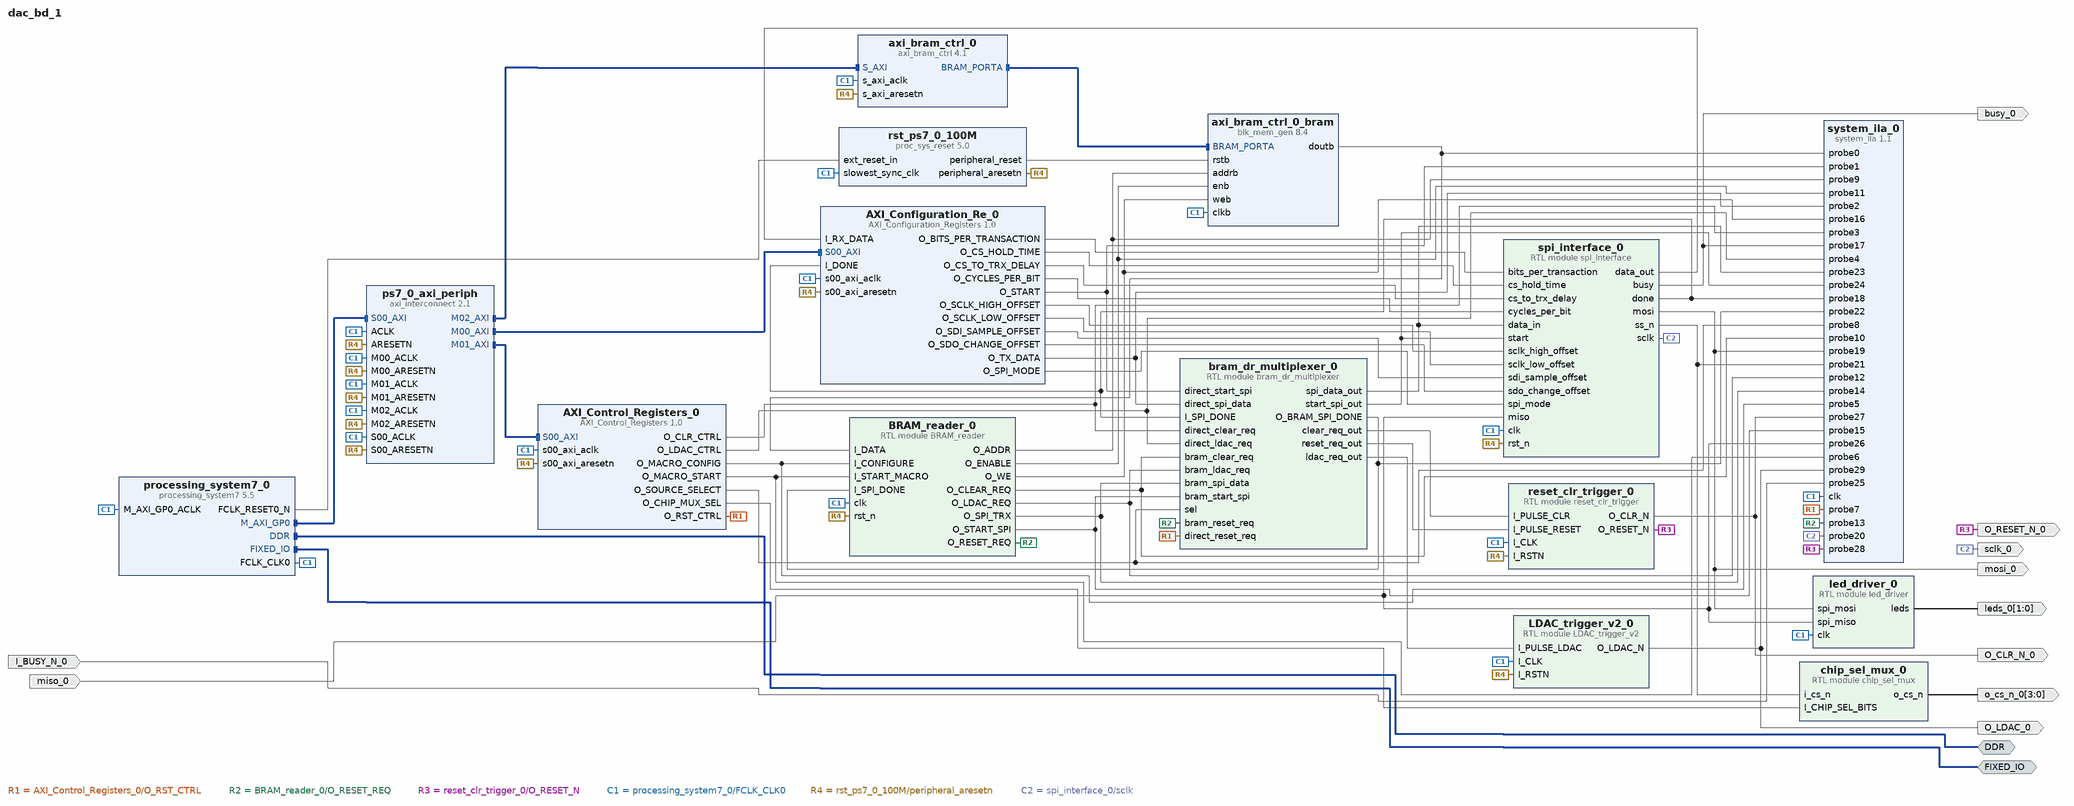
[diagram p0: block diagram of the top level]
# Vivado block design dac_bd_1, xc7z020clg400-1, Vivado 2023.1
create_bd_design dac_bd_1

create_bd_intf_port -mode Master -vlnv xilinx.com:interface:ddrx_rtl:1.0 DDR
create_bd_intf_port -mode Master -vlnv xilinx.com:display_processing_system7:fixedio_rtl:1.0 FIXED_IO
create_bd_port -dir O sclk_0
create_bd_port -dir O mosi_0
create_bd_port -dir I miso_0
create_bd_port -dir O busy_0
create_bd_port -dir I I_BUSY_N_0
create_bd_port -dir O O_LDAC_0
create_bd_port -dir O O_RESET_N_0
create_bd_port -dir O O_CLR_N_0
create_bd_port -dir O -from 1 -to 0 leds_0
create_bd_port -dir O -from 3 -to 0 o_cs_n_0

create_bd_cell -type ip -vlnv xilinx.com:ip:processing_system7:5.5 processing_system7_0
set_property -dict [list \
  CONFIG.PCW_APU_PERIPHERAL_FREQMHZ 650 \
  CONFIG.PCW_CRYSTAL_PERIPHERAL_FREQMHZ 50 \
  CONFIG.PCW_ENET0_ENET0_IO {MIO 16 .. 27} \
  CONFIG.PCW_ENET0_GRP_MDIO_ENABLE 1 \
  CONFIG.PCW_ENET0_GRP_MDIO_IO {MIO 52 .. 53} \
  CONFIG.PCW_ENET0_PERIPHERAL_ENABLE 1 \
  CONFIG.PCW_ENET0_RESET_ENABLE 1 \
  CONFIG.PCW_ENET0_RESET_IO {MIO 9} \
  CONFIG.PCW_ENET_RESET_ENABLE 1 \
  CONFIG.PCW_ENET_RESET_SELECT {Share reset pin} \
  CONFIG.PCW_FPGA0_PERIPHERAL_FREQMHZ 100 \
  CONFIG.PCW_FPGA1_PERIPHERAL_FREQMHZ 50 \
  CONFIG.PCW_GPIO_MIO_GPIO_ENABLE 1 \
  CONFIG.PCW_GPIO_MIO_GPIO_IO MIO \
  CONFIG.PCW_I2C_RESET_ENABLE 1 \
  CONFIG.PCW_M_AXI_GP0_FREQMHZ 10 \
  CONFIG.PCW_PERIPHERAL_BOARD_PRESET None \
  CONFIG.PCW_PRESET_BANK1_VOLTAGE {LVCMOS 1.8V} \
  CONFIG.PCW_QSPI_GRP_FBCLK_ENABLE 1 \
  CONFIG.PCW_QSPI_GRP_FBCLK_IO {MIO 8} \
  CONFIG.PCW_QSPI_GRP_SINGLE_SS_ENABLE 1 \
  CONFIG.PCW_QSPI_GRP_SINGLE_SS_IO {MIO 1 .. 6} \
  CONFIG.PCW_QSPI_PERIPHERAL_ENABLE 1 \
  CONFIG.PCW_QSPI_QSPI_IO {MIO 1 .. 6} \
  CONFIG.PCW_SD0_GRP_CD_ENABLE 1 \
  CONFIG.PCW_SD0_GRP_CD_IO {MIO 47} \
  CONFIG.PCW_SD0_GRP_WP_ENABLE 0 \
  CONFIG.PCW_SD0_PERIPHERAL_ENABLE 1 \
  CONFIG.PCW_SD0_SD0_IO {MIO 40 .. 45} \
  CONFIG.PCW_SDIO_PERIPHERAL_FREQMHZ 50 \
  CONFIG.PCW_SINGLE_QSPI_DATA_MODE x4 \
  CONFIG.PCW_UART0_PERIPHERAL_ENABLE 1 \
  CONFIG.PCW_UART0_UART0_IO {MIO 14 .. 15} \
  CONFIG.PCW_UART1_PERIPHERAL_ENABLE 0 \
  CONFIG.PCW_UART_PERIPHERAL_FREQMHZ 100 \
  CONFIG.PCW_UIPARAM_DDR_BUS_WIDTH {16 Bit} \
  CONFIG.PCW_UIPARAM_DDR_FREQ_MHZ 525 \
  CONFIG.PCW_UIPARAM_DDR_PARTNO {MT41J256M16 RE-125} \
  CONFIG.PCW_USB0_PERIPHERAL_ENABLE 1 \
  CONFIG.PCW_USB0_RESET_ENABLE 1 \
  CONFIG.PCW_USB0_RESET_IO {MIO 46} \
  CONFIG.PCW_USB0_USB0_IO {MIO 28 .. 39} \
  CONFIG.PCW_USB_RESET_ENABLE 1 \
  CONFIG.PCW_USB_RESET_SELECT {Share reset pin} \
] [get_bd_cells processing_system7_0]
# 481 more settings of processing_system7_0 are not shown: defaults, MIO pin electricals, DDR timing, and values the tool derives
create_bd_cell -type ip -vlnv xilinx.com:ip:axi_interconnect:2.1 ps7_0_axi_periph
set_property -dict {CONFIG.NUM_MI 3} [get_bd_cells ps7_0_axi_periph]
create_bd_cell -type ip -vlnv xilinx.com:ip:proc_sys_reset:5.0 rst_ps7_0_100M
create_bd_cell -type module -reference spi_interface spi_interface_0
create_bd_cell -type ip -vlnv xilinx.com:user:AXI_Configuration_Registers:1.0 AXI_Configuration_Re_0
create_bd_cell -type ip -vlnv xilinx.com:ip:axi_bram_ctrl:4.1 axi_bram_ctrl_0
set_property -dict {CONFIG.SINGLE_PORT_BRAM 1} [get_bd_cells axi_bram_ctrl_0]
create_bd_cell -type ip -vlnv xilinx.com:ip:blk_mem_gen:8.4 axi_bram_ctrl_0_bram
set_property -dict {CONFIG.Memory_Type True_Dual_Port_RAM} [get_bd_cells axi_bram_ctrl_0_bram]
create_bd_cell -type module -reference bram_dr_multiplexer bram_dr_multiplexer_0
create_bd_cell -type ip -vlnv xilinx.com:ip:system_ila:1.1 system_ila_0
set_property -dict [list \
  CONFIG.C_DATA_DEPTH 4096 \
  CONFIG.C_MON_TYPE NATIVE \
  CONFIG.C_NUM_OF_PROBES 30 \
  CONFIG.C_PROBE0_TYPE 0 \
  CONFIG.C_PROBE10_TYPE 0 \
  CONFIG.C_PROBE11_TYPE 0 \
  CONFIG.C_PROBE12_TYPE 0 \
  CONFIG.C_PROBE13_TYPE 0 \
  CONFIG.C_PROBE14_TYPE 0 \
  CONFIG.C_PROBE15_TYPE 0 \
  CONFIG.C_PROBE16_TYPE 0 \
  CONFIG.C_PROBE17_TYPE 0 \
  CONFIG.C_PROBE18_TYPE 0 \
  CONFIG.C_PROBE19_TYPE 0 \
  CONFIG.C_PROBE1_TYPE 0 \
  CONFIG.C_PROBE20_TYPE 0 \
  CONFIG.C_PROBE21_TYPE 0 \
  CONFIG.C_PROBE25_TYPE 0 \
  CONFIG.C_PROBE26_TYPE 0 \
  CONFIG.C_PROBE27_TYPE 0 \
  CONFIG.C_PROBE28_TYPE 0 \
  CONFIG.C_PROBE29_TYPE 0 \
  CONFIG.C_PROBE2_TYPE 0 \
  CONFIG.C_PROBE3_TYPE 0 \
  CONFIG.C_PROBE4_TYPE 0 \
  CONFIG.C_PROBE5_TYPE 0 \
  CONFIG.C_PROBE6_TYPE 0 \
  CONFIG.C_PROBE7_TYPE 0 \
  CONFIG.C_PROBE8_TYPE 0 \
  CONFIG.C_PROBE9_TYPE 0 \
] [get_bd_cells system_ila_0]
create_bd_cell -type module -reference BRAM_reader BRAM_reader_0
create_bd_cell -type module -reference led_driver led_driver_0
create_bd_cell -type module -reference LDAC_trigger_v2 LDAC_trigger_v2_0
create_bd_cell -type ip -vlnv xilinx.com:user:AXI_Control_Registers:1.0 AXI_Control_Registers_0
create_bd_cell -type module -reference chip_sel_mux chip_sel_mux_0
create_bd_cell -type module -reference reset_clr_trigger reset_clr_trigger_0

# ---- connections ----

connect_bd_intf_net [get_bd_intf_pins axi_bram_ctrl_0_bram/BRAM_PORTA] [get_bd_intf_pins axi_bram_ctrl_0/BRAM_PORTA]
connect_bd_intf_net [get_bd_intf_ports DDR] [get_bd_intf_pins processing_system7_0/DDR]
connect_bd_intf_net [get_bd_intf_ports FIXED_IO] [get_bd_intf_pins processing_system7_0/FIXED_IO]
connect_bd_intf_net [get_bd_intf_pins processing_system7_0/M_AXI_GP0] [get_bd_intf_pins ps7_0_axi_periph/S00_AXI]
connect_bd_intf_net [get_bd_intf_pins ps7_0_axi_periph/M00_AXI] [get_bd_intf_pins AXI_Configuration_Re_0/S00_AXI]
connect_bd_intf_net [get_bd_intf_pins ps7_0_axi_periph/M01_AXI] [get_bd_intf_pins AXI_Control_Registers_0/S00_AXI]
connect_bd_intf_net [get_bd_intf_pins ps7_0_axi_periph/M02_AXI] [get_bd_intf_pins axi_bram_ctrl_0/S_AXI]
connect_bd_net [get_bd_pins AXI_Configuration_Re_0/O_BITS_PER_TRANSACTION] [get_bd_pins spi_interface_0/bits_per_transaction]
connect_bd_net [get_bd_pins AXI_Configuration_Re_0/O_CS_HOLD_TIME] [get_bd_pins spi_interface_0/cs_hold_time]
connect_bd_net [get_bd_pins AXI_Configuration_Re_0/O_CS_TO_TRX_DELAY] [get_bd_pins spi_interface_0/cs_to_trx_delay]
connect_bd_net [get_bd_pins AXI_Configuration_Re_0/O_CYCLES_PER_BIT] [get_bd_pins spi_interface_0/cycles_per_bit]
connect_bd_net [get_bd_pins AXI_Configuration_Re_0/O_SCLK_HIGH_OFFSET] [get_bd_pins spi_interface_0/sclk_high_offset]
connect_bd_net [get_bd_pins AXI_Configuration_Re_0/O_SCLK_LOW_OFFSET] [get_bd_pins spi_interface_0/sclk_low_offset]
connect_bd_net [get_bd_pins AXI_Configuration_Re_0/O_SDI_SAMPLE_OFFSET] [get_bd_pins spi_interface_0/sdi_sample_offset]
connect_bd_net [get_bd_pins AXI_Configuration_Re_0/O_SDO_CHANGE_OFFSET] [get_bd_pins spi_interface_0/sdo_change_offset]
connect_bd_net [get_bd_pins AXI_Configuration_Re_0/O_SPI_MODE] [get_bd_pins spi_interface_0/spi_mode]
connect_bd_net -net AXI_Configuration_Re_0_O_START [get_bd_pins AXI_Configuration_Re_0/O_START] \
  [get_bd_pins bram_dr_multiplexer_0/direct_start_spi] [get_bd_pins system_ila_0/probe1]
connect_bd_net -net AXI_Configuration_Re_0_O_TX_DATA [get_bd_pins AXI_Configuration_Re_0/O_TX_DATA] \
  [get_bd_pins bram_dr_multiplexer_0/direct_spi_data] [get_bd_pins system_ila_0/probe2]
connect_bd_net [get_bd_pins AXI_Control_Registers_0/O_CHIP_MUX_SEL] [get_bd_pins chip_sel_mux_0/I_CHIP_SEL_BITS]
connect_bd_net -net AXI_Control_Registers_0_O_CLR_CTRL [get_bd_pins AXI_Control_Registers_0/O_CLR_CTRL] \
  [get_bd_pins bram_dr_multiplexer_0/direct_clear_req] [get_bd_pins system_ila_0/probe3]
connect_bd_net -net AXI_Control_Registers_0_O_LDAC_CTRL [get_bd_pins AXI_Control_Registers_0/O_LDAC_CTRL] \
  [get_bd_pins bram_dr_multiplexer_0/direct_ldac_req] [get_bd_pins system_ila_0/probe4]
connect_bd_net -net AXI_Control_Registers_0_O_MACRO_CONFIG [get_bd_pins AXI_Control_Registers_0/O_MACRO_CONFIG] \
  [get_bd_pins system_ila_0/probe5] [get_bd_pins BRAM_reader_0/I_CONFIGURE]
connect_bd_net -net AXI_Control_Registers_0_O_MACRO_START [get_bd_pins AXI_Control_Registers_0/O_MACRO_START] \
  [get_bd_pins system_ila_0/probe6] [get_bd_pins BRAM_reader_0/I_START_MACRO]
connect_bd_net -net AXI_Control_Registers_0_O_RST_CTRL [get_bd_pins AXI_Control_Registers_0/O_RST_CTRL] \
  [get_bd_pins bram_dr_multiplexer_0/direct_reset_req] [get_bd_pins system_ila_0/probe7]
connect_bd_net -net AXI_Control_Registers_0_O_SOURCE_SELECT [get_bd_pins AXI_Control_Registers_0/O_SOURCE_SELECT] \
  [get_bd_pins bram_dr_multiplexer_0/sel] [get_bd_pins system_ila_0/probe8]
connect_bd_net -net BRAM_reader_0_O_ADDR [get_bd_pins BRAM_reader_0/O_ADDR] [get_bd_pins axi_bram_ctrl_0_bram/addrb] [get_bd_pins system_ila_0/probe9]
connect_bd_net -net BRAM_reader_0_O_CLEAR_REQ [get_bd_pins BRAM_reader_0/O_CLEAR_REQ] \
  [get_bd_pins bram_dr_multiplexer_0/bram_clear_req] [get_bd_pins system_ila_0/probe10]
connect_bd_net -net BRAM_reader_0_O_ENABLE [get_bd_pins BRAM_reader_0/O_ENABLE] \
  [get_bd_pins axi_bram_ctrl_0_bram/enb] [get_bd_pins system_ila_0/probe11]
connect_bd_net -net BRAM_reader_0_O_LDAC_REQ [get_bd_pins BRAM_reader_0/O_LDAC_REQ] \
  [get_bd_pins bram_dr_multiplexer_0/bram_ldac_req] [get_bd_pins system_ila_0/probe12]
connect_bd_net -net BRAM_reader_0_O_RESET_REQ [get_bd_pins BRAM_reader_0/O_RESET_REQ] \
  [get_bd_pins bram_dr_multiplexer_0/bram_reset_req] [get_bd_pins system_ila_0/probe13]
connect_bd_net -net BRAM_reader_0_O_SPI_TRX [get_bd_pins BRAM_reader_0/O_SPI_TRX] \
  [get_bd_pins bram_dr_multiplexer_0/bram_spi_data] [get_bd_pins system_ila_0/probe14]
connect_bd_net -net BRAM_reader_0_O_START_SPI [get_bd_pins BRAM_reader_0/O_START_SPI] \
  [get_bd_pins bram_dr_multiplexer_0/bram_start_spi] [get_bd_pins system_ila_0/probe15]
connect_bd_net -net BRAM_reader_0_O_WE [get_bd_pins BRAM_reader_0/O_WE] [get_bd_pins axi_bram_ctrl_0_bram/web] [get_bd_pins system_ila_0/probe16]
connect_bd_net -net DAC_reset_clr_trigger_0_O_CLR_N [get_bd_pins reset_clr_trigger_0/O_CLR_N] \
  [get_bd_ports O_CLR_N_0] [get_bd_pins system_ila_0/probe27]
connect_bd_net -net DAC_reset_clr_trigger_0_O_RESET_N [get_bd_pins reset_clr_trigger_0/O_RESET_N] \
  [get_bd_ports O_RESET_N_0] [get_bd_pins system_ila_0/probe28]
connect_bd_net -net I_BUSY_N_0_1 [get_bd_ports I_BUSY_N_0] [get_bd_pins system_ila_0/probe25]
connect_bd_net -net LDAC_trigger_0_O_LDAC [get_bd_pins LDAC_trigger_v2_0/O_LDAC_N] [get_bd_ports O_LDAC_0] [get_bd_pins system_ila_0/probe29]
connect_bd_net -net axi_bram_ctrl_0_bram_doutb [get_bd_pins axi_bram_ctrl_0_bram/doutb] \
  [get_bd_pins system_ila_0/probe0] [get_bd_pins BRAM_reader_0/I_DATA]
connect_bd_net -net bram_dr_multiplexer_0_O_BRAM_SPI_DONE [get_bd_pins bram_dr_multiplexer_0/O_BRAM_SPI_DONE] \
  [get_bd_pins system_ila_0/probe22] [get_bd_pins BRAM_reader_0/I_SPI_DONE]
connect_bd_net [get_bd_pins bram_dr_multiplexer_0/clear_req_out] [get_bd_pins reset_clr_trigger_0/I_PULSE_CLR]
connect_bd_net [get_bd_pins bram_dr_multiplexer_0/ldac_req_out] [get_bd_pins LDAC_trigger_v2_0/I_PULSE_LDAC]
connect_bd_net [get_bd_pins bram_dr_multiplexer_0/reset_req_out] [get_bd_pins reset_clr_trigger_0/I_PULSE_RESET]
connect_bd_net -net bram_dr_multiplexer_0_spi_data_out [get_bd_pins bram_dr_multiplexer_0/spi_data_out] \
  [get_bd_pins spi_interface_0/data_in] [get_bd_pins system_ila_0/probe23]
connect_bd_net -net bram_dr_multiplexer_0_start_spi_out [get_bd_pins bram_dr_multiplexer_0/start_spi_out] \
  [get_bd_pins spi_interface_0/start] [get_bd_pins system_ila_0/probe24]
connect_bd_net [get_bd_pins chip_sel_mux_0/o_cs_n] [get_bd_ports o_cs_n_0]
connect_bd_net [get_bd_pins led_driver_0/leds] [get_bd_ports leds_0]
connect_bd_net -net miso_0_1 [get_bd_ports miso_0] \
  [get_bd_pins spi_interface_0/miso] [get_bd_pins led_driver_0/spi_miso] [get_bd_pins system_ila_0/probe26]
connect_bd_net [get_bd_pins processing_system7_0/FCLK_CLK0] \
  [get_bd_pins processing_system7_0/M_AXI_GP0_ACLK] [get_bd_pins ps7_0_axi_periph/S00_ACLK] \
  [get_bd_pins rst_ps7_0_100M/slowest_sync_clk] [get_bd_pins ps7_0_axi_periph/M00_ACLK] [get_bd_pins ps7_0_axi_periph/ACLK] \
  [get_bd_pins spi_interface_0/clk] [get_bd_pins AXI_Configuration_Re_0/s00_axi_aclk] [get_bd_pins ps7_0_axi_periph/M01_ACLK] \
  [get_bd_pins axi_bram_ctrl_0/s_axi_aclk] [get_bd_pins ps7_0_axi_periph/M02_ACLK] [get_bd_pins axi_bram_ctrl_0_bram/clkb] \
  [get_bd_pins system_ila_0/clk] [get_bd_pins BRAM_reader_0/clk] [get_bd_pins led_driver_0/clk] \
  [get_bd_pins LDAC_trigger_v2_0/I_CLK] [get_bd_pins AXI_Control_Registers_0/s00_axi_aclk] \
  [get_bd_pins reset_clr_trigger_0/I_CLK]
connect_bd_net [get_bd_pins processing_system7_0/FCLK_RESET0_N] [get_bd_pins rst_ps7_0_100M/ext_reset_in]
connect_bd_net [get_bd_pins rst_ps7_0_100M/peripheral_aresetn] \
  [get_bd_pins ps7_0_axi_periph/S00_ARESETN] [get_bd_pins ps7_0_axi_periph/M00_ARESETN] \
  [get_bd_pins ps7_0_axi_periph/ARESETN] [get_bd_pins spi_interface_0/rst_n] \
  [get_bd_pins AXI_Configuration_Re_0/s00_axi_aresetn] [get_bd_pins ps7_0_axi_periph/M01_ARESETN] \
  [get_bd_pins axi_bram_ctrl_0/s_axi_aresetn] [get_bd_pins ps7_0_axi_periph/M02_ARESETN] [get_bd_pins BRAM_reader_0/rst_n] \
  [get_bd_pins LDAC_trigger_v2_0/I_RSTN] [get_bd_pins AXI_Control_Registers_0/s00_axi_aresetn] \
  [get_bd_pins reset_clr_trigger_0/I_RSTN]
connect_bd_net [get_bd_pins rst_ps7_0_100M/peripheral_reset] [get_bd_pins axi_bram_ctrl_0_bram/rstb]
connect_bd_net -net spi_interface_0_busy [get_bd_pins spi_interface_0/busy] [get_bd_ports busy_0] [get_bd_pins system_ila_0/probe17]
connect_bd_net [get_bd_pins spi_interface_0/data_out] [get_bd_pins AXI_Configuration_Re_0/I_RX_DATA]
connect_bd_net -net spi_interface_0_done [get_bd_pins spi_interface_0/done] \
  [get_bd_pins AXI_Configuration_Re_0/I_DONE] [get_bd_pins bram_dr_multiplexer_0/I_SPI_DONE] \
  [get_bd_pins system_ila_0/probe18]
connect_bd_net -net spi_interface_0_mosi [get_bd_pins spi_interface_0/mosi] \
  [get_bd_ports mosi_0] [get_bd_pins system_ila_0/probe19] [get_bd_pins led_driver_0/spi_mosi]
connect_bd_net -net spi_interface_0_sclk [get_bd_pins spi_interface_0/sclk] [get_bd_ports sclk_0] [get_bd_pins system_ila_0/probe20]
connect_bd_net -net spi_interface_0_ss_n [get_bd_pins spi_interface_0/ss_n] [get_bd_pins system_ila_0/probe21] [get_bd_pins chip_sel_mux_0/i_cs_n]
set_property HDL_ATTRIBUTE.BMM_INFO_PROCESSOR {arm > dac_bd_1 axi_bram_ctrl_0} [get_bd_cells processing_system7_0]
set_property HDL_ATTRIBUTE.KEEP_HIERARCHY yes [get_bd_cells processing_system7_0]
set_property HDL_ATTRIBUTE.BMM_INFO_ADDRESS_SPACE {byte  0x40000000 32 > dac_bd_1 axi_bram_ctrl_0_bram} [get_bd_cells axi_bram_ctrl_0]
set_property HDL_ATTRIBUTE.KEEP_HIERARCHY yes [get_bd_cells axi_bram_ctrl_0]
set_property HDL_ATTRIBUTE.DEBUG true [get_bd_nets AXI_Configuration_Re_0_O_START]
set_property HDL_ATTRIBUTE.MARK_DEBUG true [get_bd_nets AXI_Configuration_Re_0_O_START]
set_property HDL_ATTRIBUTE.DEBUG true [get_bd_nets AXI_Configuration_Re_0_O_TX_DATA]
set_property HDL_ATTRIBUTE.MARK_DEBUG true [get_bd_nets AXI_Configuration_Re_0_O_TX_DATA]
set_property HDL_ATTRIBUTE.DEBUG true [get_bd_nets AXI_Control_Registers_0_O_CLR_CTRL]
set_property HDL_ATTRIBUTE.MARK_DEBUG true [get_bd_nets AXI_Control_Registers_0_O_CLR_CTRL]
set_property HDL_ATTRIBUTE.DEBUG true [get_bd_nets AXI_Control_Registers_0_O_LDAC_CTRL]
set_property HDL_ATTRIBUTE.MARK_DEBUG true [get_bd_nets AXI_Control_Registers_0_O_LDAC_CTRL]
set_property HDL_ATTRIBUTE.DEBUG true [get_bd_nets AXI_Control_Registers_0_O_MACRO_CONFIG]
set_property HDL_ATTRIBUTE.MARK_DEBUG true [get_bd_nets AXI_Control_Registers_0_O_MACRO_CONFIG]
set_property HDL_ATTRIBUTE.DEBUG true [get_bd_nets AXI_Control_Registers_0_O_MACRO_START]
set_property HDL_ATTRIBUTE.MARK_DEBUG true [get_bd_nets AXI_Control_Registers_0_O_MACRO_START]
set_property HDL_ATTRIBUTE.DEBUG true [get_bd_nets AXI_Control_Registers_0_O_RST_CTRL]
set_property HDL_ATTRIBUTE.MARK_DEBUG true [get_bd_nets AXI_Control_Registers_0_O_RST_CTRL]
set_property HDL_ATTRIBUTE.DEBUG true [get_bd_nets AXI_Control_Registers_0_O_SOURCE_SELECT]
set_property HDL_ATTRIBUTE.MARK_DEBUG true [get_bd_nets AXI_Control_Registers_0_O_SOURCE_SELECT]
set_property HDL_ATTRIBUTE.DEBUG true [get_bd_nets BRAM_reader_0_O_ADDR]
set_property HDL_ATTRIBUTE.MARK_DEBUG true [get_bd_nets BRAM_reader_0_O_ADDR]
set_property HDL_ATTRIBUTE.DEBUG true [get_bd_nets BRAM_reader_0_O_CLEAR_REQ]
set_property HDL_ATTRIBUTE.MARK_DEBUG true [get_bd_nets BRAM_reader_0_O_CLEAR_REQ]
set_property HDL_ATTRIBUTE.DEBUG true [get_bd_nets BRAM_reader_0_O_ENABLE]
set_property HDL_ATTRIBUTE.MARK_DEBUG true [get_bd_nets BRAM_reader_0_O_ENABLE]
set_property HDL_ATTRIBUTE.DEBUG true [get_bd_nets BRAM_reader_0_O_LDAC_REQ]
set_property HDL_ATTRIBUTE.MARK_DEBUG true [get_bd_nets BRAM_reader_0_O_LDAC_REQ]
set_property HDL_ATTRIBUTE.DEBUG true [get_bd_nets BRAM_reader_0_O_RESET_REQ]
set_property HDL_ATTRIBUTE.MARK_DEBUG true [get_bd_nets BRAM_reader_0_O_RESET_REQ]
set_property HDL_ATTRIBUTE.DEBUG true [get_bd_nets BRAM_reader_0_O_SPI_TRX]
set_property HDL_ATTRIBUTE.MARK_DEBUG true [get_bd_nets BRAM_reader_0_O_SPI_TRX]
set_property HDL_ATTRIBUTE.DEBUG true [get_bd_nets BRAM_reader_0_O_START_SPI]
set_property HDL_ATTRIBUTE.MARK_DEBUG true [get_bd_nets BRAM_reader_0_O_START_SPI]
set_property HDL_ATTRIBUTE.DEBUG true [get_bd_nets BRAM_reader_0_O_WE]
set_property HDL_ATTRIBUTE.MARK_DEBUG true [get_bd_nets BRAM_reader_0_O_WE]
set_property HDL_ATTRIBUTE.DEBUG true [get_bd_nets DAC_reset_clr_trigger_0_O_CLR_N]
set_property HDL_ATTRIBUTE.MARK_DEBUG true [get_bd_nets DAC_reset_clr_trigger_0_O_CLR_N]
set_property HDL_ATTRIBUTE.DEBUG true [get_bd_nets DAC_reset_clr_trigger_0_O_RESET_N]
set_property HDL_ATTRIBUTE.MARK_DEBUG true [get_bd_nets DAC_reset_clr_trigger_0_O_RESET_N]
set_property HDL_ATTRIBUTE.DEBUG true [get_bd_nets I_BUSY_N_0_1]
set_property HDL_ATTRIBUTE.MARK_DEBUG true [get_bd_nets I_BUSY_N_0_1]
set_property HDL_ATTRIBUTE.DEBUG true [get_bd_nets LDAC_trigger_0_O_LDAC]
set_property HDL_ATTRIBUTE.MARK_DEBUG true [get_bd_nets LDAC_trigger_0_O_LDAC]
set_property HDL_ATTRIBUTE.DEBUG true [get_bd_nets axi_bram_ctrl_0_bram_doutb]
set_property HDL_ATTRIBUTE.MARK_DEBUG true [get_bd_nets axi_bram_ctrl_0_bram_doutb]
set_property HDL_ATTRIBUTE.DEBUG true [get_bd_nets bram_dr_multiplexer_0_O_BRAM_SPI_DONE]
set_property HDL_ATTRIBUTE.MARK_DEBUG true [get_bd_nets bram_dr_multiplexer_0_O_BRAM_SPI_DONE]
set_property HDL_ATTRIBUTE.DEBUG true [get_bd_nets bram_dr_multiplexer_0_spi_data_out]
set_property HDL_ATTRIBUTE.MARK_DEBUG true [get_bd_nets bram_dr_multiplexer_0_spi_data_out]
set_property HDL_ATTRIBUTE.DEBUG true [get_bd_nets bram_dr_multiplexer_0_start_spi_out]
set_property HDL_ATTRIBUTE.MARK_DEBUG true [get_bd_nets bram_dr_multiplexer_0_start_spi_out]
set_property HDL_ATTRIBUTE.DEBUG true [get_bd_nets miso_0_1]
set_property HDL_ATTRIBUTE.MARK_DEBUG true [get_bd_nets miso_0_1]
set_property HDL_ATTRIBUTE.DEBUG true [get_bd_nets spi_interface_0_busy]
set_property HDL_ATTRIBUTE.MARK_DEBUG true [get_bd_nets spi_interface_0_busy]
set_property HDL_ATTRIBUTE.DEBUG true [get_bd_nets spi_interface_0_done]
set_property HDL_ATTRIBUTE.MARK_DEBUG true [get_bd_nets spi_interface_0_done]
set_property HDL_ATTRIBUTE.DEBUG true [get_bd_nets spi_interface_0_mosi]
set_property HDL_ATTRIBUTE.MARK_DEBUG true [get_bd_nets spi_interface_0_mosi]
set_property HDL_ATTRIBUTE.DEBUG true [get_bd_nets spi_interface_0_sclk]
set_property HDL_ATTRIBUTE.MARK_DEBUG true [get_bd_nets spi_interface_0_sclk]
set_property HDL_ATTRIBUTE.DEBUG true [get_bd_nets spi_interface_0_ss_n]
set_property HDL_ATTRIBUTE.MARK_DEBUG true [get_bd_nets spi_interface_0_ss_n]

# ---- address map ----
assign_bd_address -offset 0x40000000 -range 8K -target_address_space [get_bd_addr_spaces processing_system7_0/Data] [get_bd_addr_segs axi_bram_ctrl_0/S_AXI/Mem0]
assign_bd_address -offset 0x43C00000 -range 64K -target_address_space [get_bd_addr_spaces processing_system7_0/Data] [get_bd_addr_segs AXI_Configuration_Re_0/S00_AXI/S00_AXI_reg]
assign_bd_address -offset 0x43C10000 -range 64K -target_address_space [get_bd_addr_spaces processing_system7_0/Data] [get_bd_addr_segs AXI_Control_Registers_0/S00_AXI/S00_AXI_reg]

validate_bd_design
save_bd_design
